# EAGLE design Z-Taster (EAGLE 7.2.0)
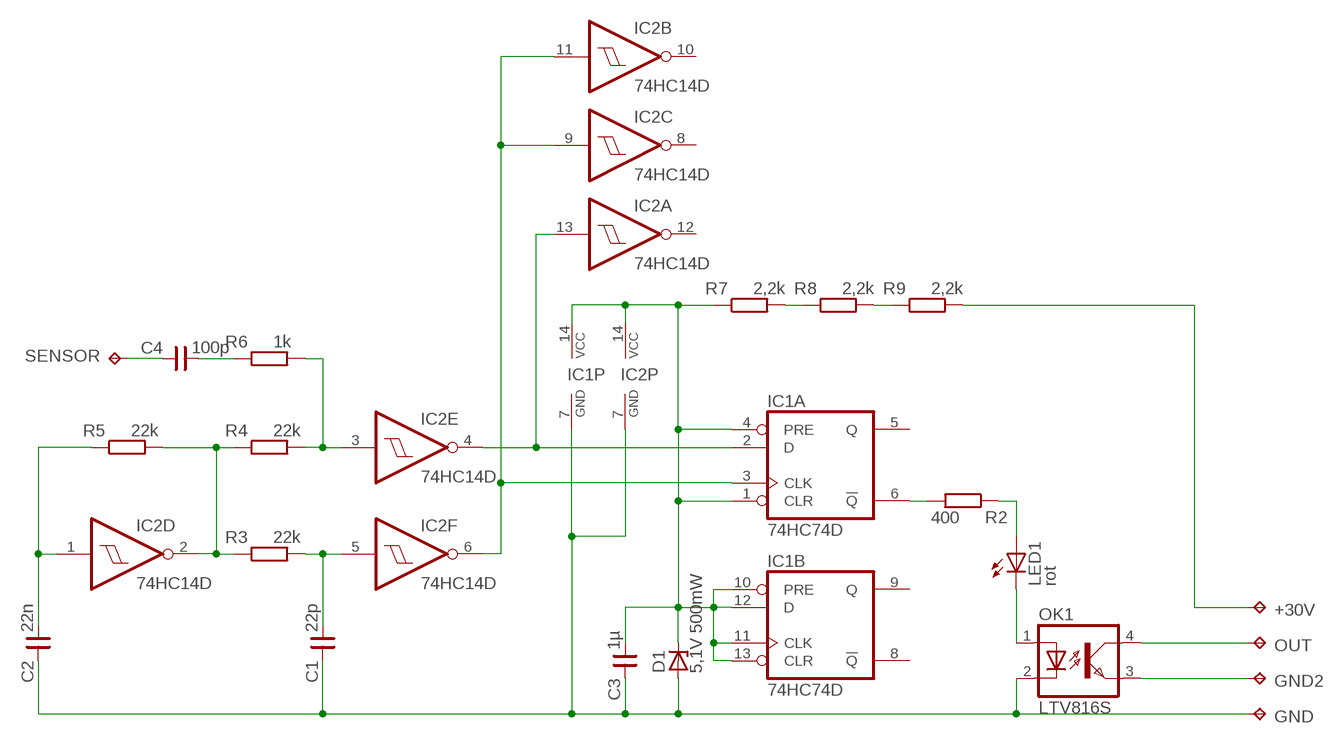
[diagram p0: schematic, sheet 1]

## Parts
+30V  TPTP20SQ  [TP20SQ]
C1  22p  C0805  [R0805]
C2  22n  C0805  [R0805]
C3  1µ  C0805  [R0805]
C4  100p  C0805  [R0805]
D1  5,1V 500mW  ZENER-DIODESOD80C  [SOD80C]
GND  TPTP18SQ  [TP18SQ]
GND2  TPTP18SQ  [TP18SQ]
IC1  74HC74D  [SO14]
IC2  74HC14D  [SO14]
LED1  rot  LED0805  [LED0805]
OK1  LTV816S  [SMD4]
OUT  TPTP18SQ  [TP18SQ]
R2  400  R805  [R0805]
R3  22k  R805  [R0805]
R4  22k  R805  [R0805]
R5  22k  R805  [R0805]
R6  1k  R805  [R0805]
R7  2,2k  R805  [R0805]
R8  2,2k  R805  [R0805]
R9  2,2k  R805  [R0805]
SENSOR  TPTP18SQ  [TP18SQ]

## Nets
GND: C1.1 C2.1 C3.1 D1.A GND.TP IC1.7(P:GND) IC2.7(P:GND) OK1.2(C)
N$1: C4.2 R6.1
N$2: IC2.2(D:O) R3.1 R4.1 R5.2
N$3: IC2.3(E:I) R4.2 R6.2
N$4: C2.2 IC2.1(D:I) R5.1
N$5: C1.2 IC2.5(F:I) R3.2
N$7: IC1.2(A:D) IC2.4(E:O) IC2.13(A:I)
N$8: IC1.3(A:CLK) IC2.6(F:O) IC2.9(C:I) IC2.11(B:I)
N$9: R7.2 R8.1
N$10: R8.2 R9.1
N$11: LED1.A R2.1
N$12: IC1.6(A:!Q) R2.2
N$16: +30V.TP R9.2
N$17: LED1.C OK1.1(A)
N$18: OK1.4(COL) OUT.TP
N$21: GND2.TP OK1.3(EMIT)
SENSOR: C4.1 SENSOR.TP
VCC: C3.2 D1.C IC1.1(A:CLR) IC1.4(A:PRE) IC1.10(B:PRE) IC1.11(B:CLK) IC1.12(B:D) IC1.13(B:CLR) IC1.14(P:VCC) IC2.14(P:VCC) R7.1
Unconnected: IC1.5(A:Q) IC1.8(B:!Q) IC1.9(B:Q) IC2.8(C:O) IC2.10(B:O) IC2.12(A:O)

## Library data of the parts
+30V GND GND2 OUT SENSOR = testpad:TP: Test pad
C1-C4 = &RLC:C
D1 = &Diodes:ZENER-DIODE: Z-Diode
IC1 = 74xx-eu:74*74: Dual D type positive edge triggered FLIP FLOP, preset and clear
IC2 = 74xx-eu:74*14: Hex schmitt trigger INVERTER
LED1 = &LED:LED: LED OSRAM: - CHIPLED LG R971, LG N971, LY N971, LG Q971, LY Q971, LO R971, LY R971 LH N974, LH R974 LS Q976, LO Q976, LY Q976 LO Q996 - Hyper CHIPLED LW Q18S LB Q993, LB Q99A, LB R99A - SideLED LS A670, LO A670, LY A670, LG A670, LP A670 LB A673, LV A673, LT A673, LW A673 LH A674 LY A675 LS A676, LA A676, LO A676, LY A676, LW A676 LS A679, LY A679, LG A679 - Hyper Micro SIDELED® LS Y876, LA Y876, LO Y876, LY Y876 LT Y87S - SmartLED LW L88C, LW L88S LB L89C, LB L89S, LG L890 LS L89K, LO L89K, LY L89K LS L896, LA L896, LO L896, LY L896 - TOPLED LS T670, LO T670, LY T670, LG T670, LP T670 LSG T670, LSP T670, LSY T670, LOP T670, LYG T670 LG T671, LOG T671, LSG T671 LB T673, LV T673, LT T673, LW T673 LH T674 LS T676, LA T676, LO T676, LY T676, LB T676, LH T676, LSB T676, LW T676 LB T67C, LV T67C, LT T67C, LS T67K, LO T67K, LY T67K, LW E67C LS E67B, LA E67B, LO E67B, LY E67B, LB E67C, LV E67C, LT E67C LW T67C LS T679, LY T679, LG T679 LS T770, LO T770, LY T770, LG T770, LP T770 LB T773, LV T773, LT T773, LW T773 LH T774 LS E675, LA E675, LY E675, LS T675 LS T776, LA T776, LO T776, LY T776, LB T776 LHGB T686 LT T68C, LB T68C - Hyper Mini TOPLED® LB M676 - Mini TOPLED Santana® LG M470 LS M47K, LO M47K, LY M47K Source: http://www.osram.convergy.de LUXEON: - LUMILED® LXK2-PW12-R00, LXK2-PW12-S00, LXK2-PW14-U00, LXK2-PW14-V00 LXK2-PM12-R00, LXK2-PM12-S00, LXK2-PM14-U00 LXK2-PE12-Q00, LXK2-PE12-R00, LXK2-PE12-S00, LXK2-PE14-T00, LXK2-PE14-U00 LXK2-PB12-K00, LXK2-PB12-L00, LXK2-PB12-M00, LXK2-PB14-N00, LXK2-PB14-P00, LXK2-PB14-Q00 LXK2-PR12-L00, LXK2-PR12-M00, LXK2-PR14-Q00, LXK2-PR14-R00 LXK2-PD12-Q00, LXK2-PD12-R00, LXK2-PD12-S00 LXK2-PH12-R00, LXK2-PH12-S00 LXK2-PL12-P00, LXK2-PL12-Q00, LXK2-PL12-R00 Source: www.luxeon.com KINGBRIGHT: KA-3528ASYC Source: www.kingbright.com
OK1 = &Optokoppler:LTV816: OPTO COUPLER Source: LITEON, LTV816.pdf; OC_FARNELL: unknown; OC_NEWARK: unknown
R2-R9 = &RLC:R: RESISTOR, European symbol

## Board
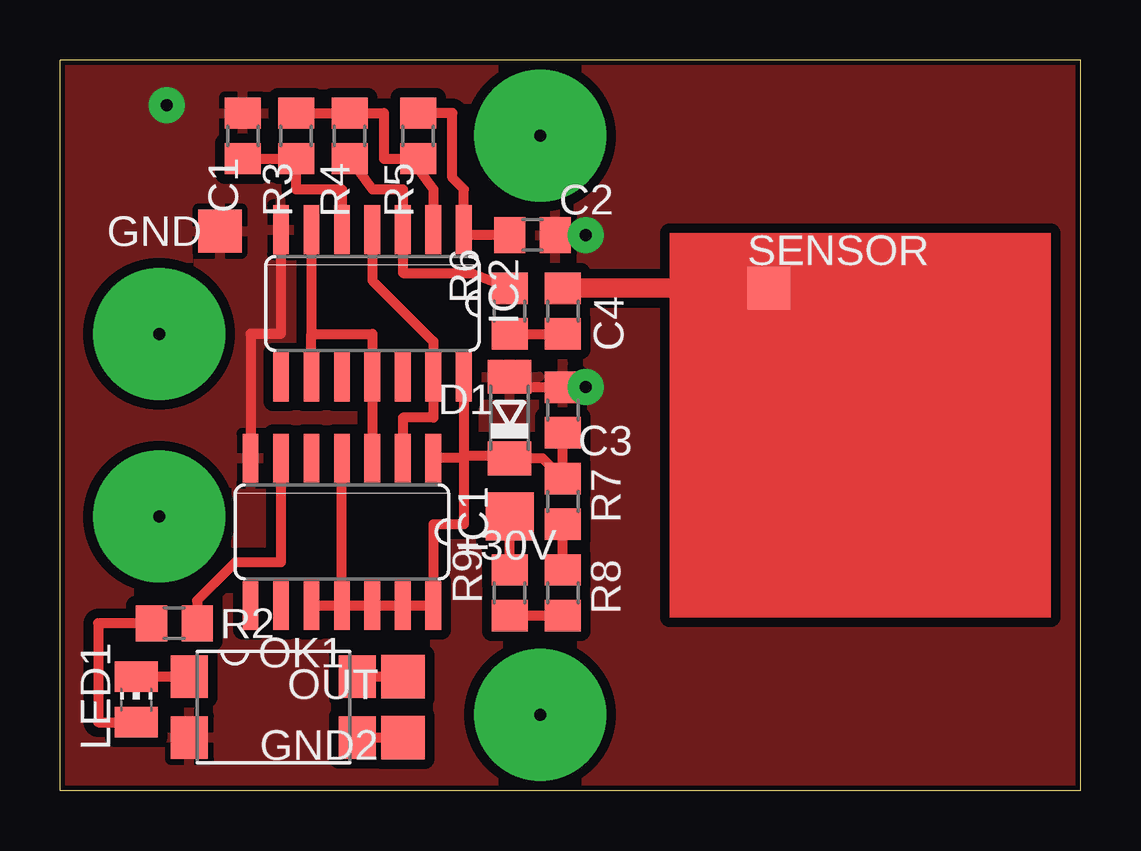
[diagram p1: board, top side]
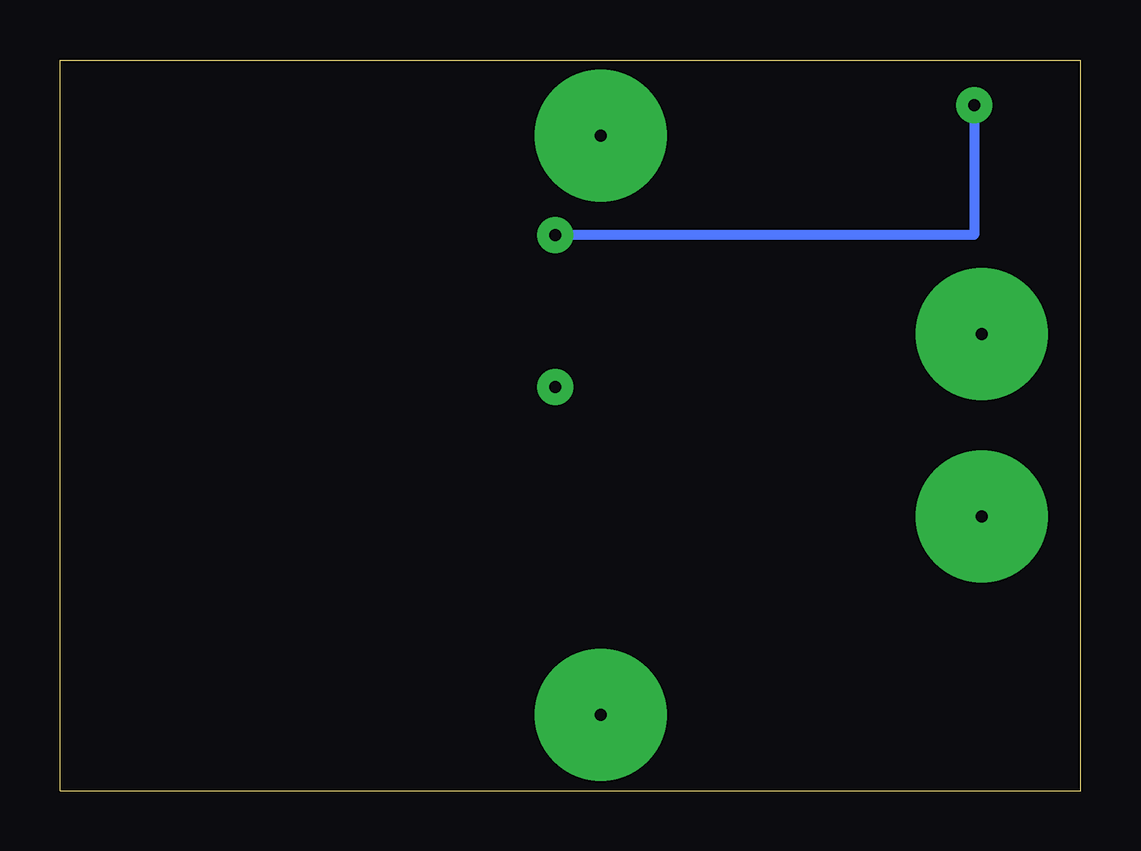
[diagram p2: board, bottom side, seen from below]

Size 42.53 x 30.47 mm. Coordinates in mm from the lower left corner, seen from the top.
Outline: 42.53,0 42.53,30.47 0,30.47 0,0 42.53,0
Copper layers (1*16): Top 0.035mm / dielectric 1.5mm / Bottom 0.035mm
Design rules "default *": minimum track width 16mil, minimum drill 16mil, track to track 16mil, track to pad 16mil, pad to pad 16mil, via to via 16mil, smd to smd 8mil, copper to edge 8mil, drill to drill 8mil, minimum pad ring 10mil, minimum via ring 8mil, stop-mask expansion 4mil, vias tented up to drill 0mil, thermal gap 10mil

### Footprints (pad centres in the part's own frame; a part is rotated, then mirrored left to right if it is on the bottom)
TP20SQ = smd 2 x 2: TP 0,0
R0805 = smd 1.3 x 1.5: 1 -0.95,0; 2 0.95,0
SOD80C = smd 1.4 x 1.8: A 1.7,0; C -1.7,0
TP18SQ = smd 1.8 x 1.8: TP 0,0
SO14 = smd 0.66 x 2.032: 1 -3.81,-3.073; 2 -2.54,-3.073; 3 -1.27,-3.073; 4 0,-3.073; 5 1.27,-3.073; 6 2.54,-3.073; 7 3.81,-3.073; 8 3.81,3.073; 9 2.54,3.073; 10 1.27,3.073; 11 0,3.073; 12 -1.27,3.073; 13 -2.54,3.073; 14 -3.81,3.073
LED0805 = smd 1.778 x 1.27: A 0,-0.953; C 0,0.953
SMD4 = smd 1.78 x 1.55: 1 -1.27,-3.5; 2 1.27,-3.5; 3 1.27,3.5; 4 -1.27,3.5

### Placement (x,y rotation side)
+30V  18.73,11.43 0 top
C1  7.62,27.3 270 top
C2  19.68,23.18 180 top
C3  20.95,15.88 270 top
C4  20.95,20 270 top
D1  18.73,15.56 90 top
GND  6.67,23.34 0 top
GND2  14.29,2.22 0 top
IC1  11.75,10.79 180 top
IC2  13.02,20.32 180 top
LED1  3.17,3.81 0 top
OK1  8.89,3.49 270 top
OUT  14.29,4.76 0 top
R2  4.76,6.99 0 top
R3  9.84,27.3 270 top
R4  12.06,27.3 270 top
R5  14.92,27.3 270 top
R6  18.73,20 90 top
R7  20.95,12.06 270 top
R8  20.95,8.26 270 top
R9  18.73,8.26 90 top
SENSOR  29.53,20.95 0 top

### Tracks (layer width: path | path; a pad name or v marks a point on that pad's centre or on a via)
GND  (via drill 0.5 pad 1.5)
  Top 0.406: IC2.7 9.21,19.05 8.26,19.05 7.94,19.05 IC1.7 | D1.A 18.73,16.82 C3.1
  Bottom 0.406: v4.45,28.57 4.45,23.18 v21.91,23.18
  other vias: 21.91,16.83
  pour Top: -1,31.48 43.55,31.48 43.55,-1 -1,-1
N$1
  Top 0.406: R6.1 C4.2
N$2
  Top 0.406: R3.1 R4.1 13.49,28.25 13.49,26.35 14.61,26.35 | R5.2 14.61,26.35 | 14.61,26.35 15.56,25.08 IC2.2
N$3
  Top 0.406: R4.2 13.02,25.08 14.29,25.08 IC2.3 14.29,21.59 17.14,21.59 17.15,21.59 R6.2
N$4
  Top 0.406: R5.1 16.35,28.25 16.35,25.56 16.83,25.08 IC2.1 16.83,23.18 | C2.2 16.83,23.18 | 16.83,23.18
N$5
  Top 0.406: IC2.5 11.75,25.08 9.84,25.08 R3.2 C1.2
N$7
  Top 0.406: IC2.4 13.02,21.27 15.56,18.73 IC2.13 15.56,15.56 14.29,15.56 IC1.2
N$8
  Top 0.406: IC2.6 10.48,19.05 | 10.48,19.05 13.02,19.05 IC2.11 IC1.3 | IC2.9 10.48,19.05
N$9
  Top 0.406: R8.1 R7.2
N$10
  Top 0.406: R9.1 R8.2
N$11
  Top 0.406: R2.1 1.59,6.99 1.59,2.86 LED1.A
N$12
  Top 0.406: IC1.6 9.21,9.53 7.3,9.53 5.71,7.94 R2.2
N$14  (via drill 0.5 pad 5.5)
  other vias: 20,3.17
N$16
  Top 0.406: R9.2 +30V.TP
N$17
  Top 0.406: LED1.C OK1.1
N$18
  Top 0.406: OK1.4 OUT.TP
N$19  (via drill 0.5 pad 5.5)
  other vias: 20,27.3
N$20  (via drill 0.5 pad 5.5)
  other vias: 4.13,11.43
N$21
  Top 0.406: OK1.3 GND2.TP
N$24  (via drill 0.5 pad 5.5)
  other vias: 4.13,19.05
SENSOR
  Top 0.406: C4.1
  Top 0.813: C4.1 SENSOR.TP
VCC
  Top 0.406: IC1.10 IC1.11 | IC1.11 IC1.12 IC1.13 IC1.14 15.56,11.11 16.83,11.11 16.83,13.87 | IC1.11 IC1.4 | IC2.14 16.83,13.97 | C3.2 R7.1 20.11,13.86 D1.C 18.62,13.97 16.83,13.97 | 16.83,13.97 16.83,13.87 | 16.83,13.87 IC1.1
(copper drawn outside any net)
  shapes: Top area x1